# Altium schematic sheet audioCodec.SchDoc
size A4
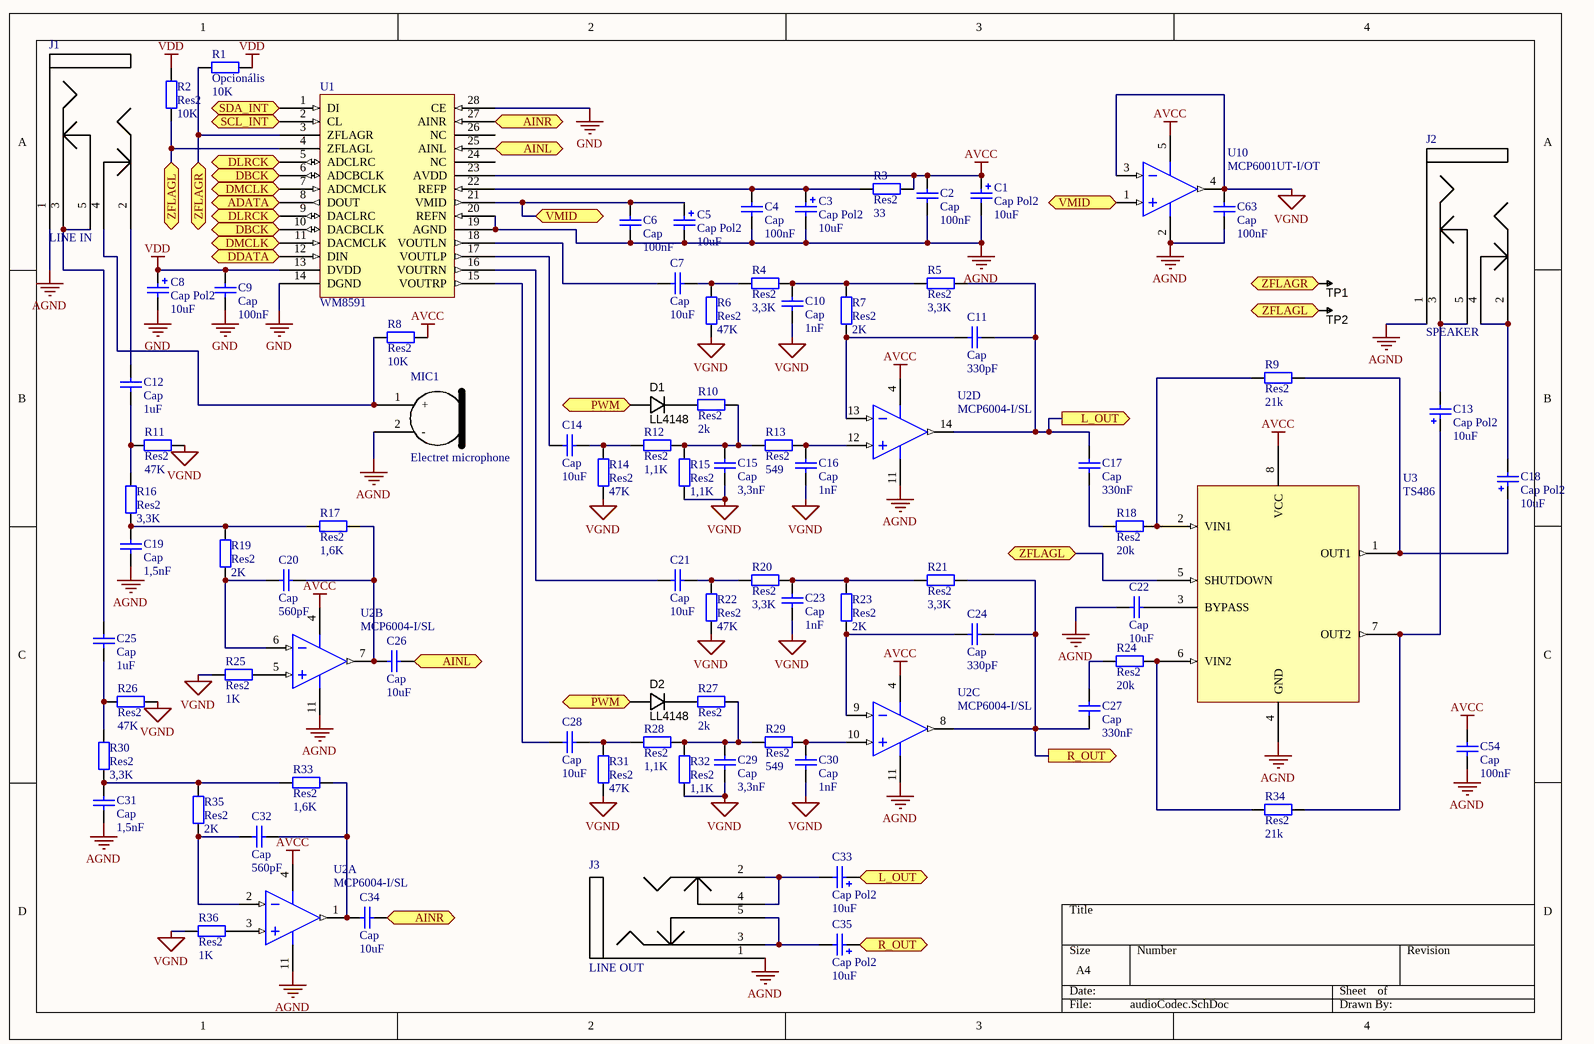
[diagram p0: audioCodec.SchDoc]

## Parts
C1  Cap Pol2  value 10uF  [CAPMP3528X210N]
C2  Cap  value 100nF  [CAPC2012X135N]
C3  Cap Pol2  value 10uF  [CAPMP3528X210N]
C4  Cap  value 100nF  [CAPC2012X135N]
C5  Cap Pol2  value 10uF  [CAPMP3528X210N]
C6  Cap  value 100nF  [CAPC2012X135N]
C7  Cap  value 10uF  [CAPC2012X135N]
C8  Cap Pol2  value 10uF  [CAPMP3528X210N]
C9  Cap  value 100nF  [CAPC2012X135N]
C10  Cap  value 1nF  [CAPC2012X135N]
C11  Cap  value 330pF  [CAPC2012X135N]
C12  Cap  value 1uF  [CAPC2012X135N]
C13  Cap Pol2  value 10uF  [CAPMP3528X210N]
C14  Cap  value 10uF  [CAPC2012X135N]
C15  Cap  value 3,3nF  [CAPC2012X135N]
C16  Cap  value 1nF  [CAPC2012X135N]
C17  Cap  value 330nF  [CAPC2012X135N]
C18  Cap Pol2  value 10uF  [CAPMP3528X210N]
C19  Cap  value 1,5nF  [CAPC2012X135N]
C20  Cap  value 560pF  [CAPC2012X135N]
C21  Cap  value 10uF  [CAPC2012X135N]
C22  Cap  value 10uF  [CAPC2012X135N]
C23  Cap  value 1nF  [CAPC2012X135N]
C24  Cap  value 330pF  [CAPC2012X135N]
C25  Cap  value 1uF  [CAPC2012X135N]
C26  Cap  value 10uF  [CAPC2012X135N]
C27  Cap  value 330nF  [CAPC2012X135N]
C28  Cap  value 10uF  [CAPC2012X135N]
C29  Cap  value 3,3nF  [CAPC2012X135N]
C30  Cap  value 1nF  [CAPC2012X135N]
C31  Cap  value 1,5nF  [CAPC2012X135N]
C32  Cap  value 560pF  [CAPC2012X135N]
C33  Cap Pol2  value 10uF  [CAPMP3528X210N]
C34  Cap  value 10uF  [CAPC2012X135N]
C35  Cap Pol2  value 10uF  [CAPMP3528X210N]
C54  Cap  value 100nF  [CAPC2012X135N]
C63  Cap  value 100nF  [CAPC2012X135N]
D1  Manufacturer Part Number 1: LL4148  [SOD80, LL-34]  (hidden comment: Mini MELF)
D2  Manufacturer Part Number 1: LL4148  [SOD80, LL-34]  (hidden comment: Mini MELF)
J1  LINE IN  [STEREO JACK 3.5 mm]
J2  SPEAKER  [STEREO JACK 3.5 mm]
J3  LINE OUT  [STEREO JACK 3.5 mm]
MIC1  Electret microphone  [MIC 10 mm]
R1  Opcionális  value 10K  [RESC2012X70N]
R2  Res2  value 10K  [RESC2012X70N]
R3  Res2  value 33  [RESC2012X70N]
R4  Res2  value 3,3K  [RESC2012X70N]
R5  Res2  value 3,3K  [RESC2012X70N]
R6  Res2  value 47K  [RESC2012X70N]
R7  Res2  value 2K  [RESC2012X70N]
R8  Res2  value 10K  [RESC2012X70N]
R9  Res2  value 21k  [RESC2012X70N]
R10  Res2  value 2k  [RESC2012X70N]
R11  Res2  value 47K  [RESC2012X70N]
R12  Res2  value 1,1K  [RESC2012X70N]
R13  Res2  value 549  [RESC2012X70N]
R14  Res2  value 47K  [RESC2012X70N]
R15  Res2  value 1,1K  [RESC2012X70N]
R16  Res2  value 3,3K  [RESC2012X70N]
R17  Res2  value 1,6K  [RESC2012X70N]
R18  Res2  value 20k  [RESC2012X70N]
R19  Res2  value 2K  [RESC2012X70N]
R20  Res2  value 3,3K  [RESC2012X70N]
R21  Res2  value 3,3K  [RESC2012X70N]
R22  Res2  value 47K  [RESC2012X70N]
R23  Res2  value 2K  [RESC2012X70N]
R24  Res2  value 20k  [RESC2012X70N]
R25  Res2  value 1K  [RESC2012X70N]
R26  Res2  value 47K  [RESC2012X70N]
R27  Res2  value 2k  [RESC2012X70N]
R28  Res2  value 1,1K  [RESC2012X70N]
R29  Res2  value 549  [RESC2012X70N]
R30  Res2  value 3,3K  [RESC2012X70N]
R31  Res2  value 47K  [RESC2012X70N]
R32  Res2  value 1,1K  [RESC2012X70N]
R33  Res2  value 1,6K  [RESC2012X70N]
R34  Res2  value 21k  [RESC2012X70N]
R35  Res2  value 2K  [RESC2012X70N]
R36  Res2  value 1K  [RESC2012X70N]
TP1  TESTPOINT  [TP-R60]  (value not drawn)  (no BOM)
TP2  TESTPOINT  [TP-R60]  (value not drawn)  (no BOM)
U1  WM8591  [SSOP-28]
U2  MCP6004-I/SL  [SOIC-SL14_N]  (parts A,B,C,D of 4)
U3  TS486  [MSOP-MS8_M]
U10  MCP6001UT-I/OT  [SOT-23-OT5_M]

## Ports
ADATA (out), AINL (in), AINL (out), AINR (in), AINR (out), DBCK (bidir), DDATA (in), DLRCK (bidir), DMCLK (bidir), L_OUT (in), L_OUT (out), PWM, R_OUT (in), R_OUT (out), SCL_INT (bidir), SDA_INT (bidir), VMID, ZFLAGL (bidir), ZFLAGR (bidir)

## Nets
AGND: C1.2 C2.2 C3.2 C4.2 C5.2 C6.2 C19.2 C22.2 C31.2 C54.2 C63.2 J1.1 J2.1 J3.1 MIC1.2(-) U1.19(AGND) U1.20(REFN) U2.11(VSS) U3.4(GND) U10.2(VSS)
AVCC: C1.1 C2.1 C54.1 R3.1 R8.2 U1.23(AVDD) U2.4(VDD) U3.8(VCC) U10.5(VDD)
GND: C8.2 C9.2 U1.14(DGND) U1.28(CE)
VDD: C8.1 C9.1 R1.1 R2.1 U1.13(DVDD)
VGND: C10.2 C15.2 C16.2 C23.2 C29.2 C30.2 C63.1 R6.1 R11.2 R14.1 R15.2 R22.1 R25.2 R26.2 R31.1 R32.2 R36.2 U10.3(VIN-) U10.4(VOUT)
ADATA: U1.8(DOUT) ; port ADATA
AINL: C26.1 U1.25(AINL) ; port AINL
AINR: C34.1 U1.27(AINR) ; port AINR
DBCK: U1.6(ADCBCLK) U1.10(DACBCLK) ; port DBCK
DDATA: U1.12(DIN) ; port DDATA
DLRCK: U1.5(ADCLRC) U1.9(DACLRC) ; port DLRCK
DMCLK: U1.7(ADCMCLK) U1.11(DACMCLK) ; port DMCLK
L_OUT: C11.2 C17.1 C33.1 R5.1 U2.14(VOUTD) ; port L_OUT
PWM: D1.A D2.A ; port PWM
R_OUT: C24.2 C27.2 C35.1 R21.1 U2.8(VOUTC) ; port R_OUT
SCL_INT: U1.2(CL) ; port SCL_INT
SDA_INT: U1.1(DI) ; port SDA_INT
VMID: C5.1 C6.1 U1.21(VMID) U10.1(VIN+) ; port VMID
ZFLAGL: R2.2 TP2.1 U1.4(ZFLAGL) U3.5(SHUTDOWN) ; port ZFLAGL
ZFLAGR: R1.2 TP1.1 U1.3(ZFLAGR) ; port ZFLAGR
NetC3_1: C3.1 C4.1 R3.2 U1.22(REFP)
NetC7_1: C7.1 R4.2 R6.2
NetC7_2: C7.2 U1.18(VOUTLN)
NetC10_1: C10.1 R4.1 R5.2 R7.2
NetC11_1: C11.1 R7.1 U2.13(VIND-)
NetC12_1: C12.1 J1.2
NetC12_2: C12.2 R11.1 R16.1
NetC13_1: C13.1 R34.1 U3.7(OUT2)
NetC13_2: C13.2 J2.3 J2.5
NetC14_1: C14.1 R12.2 R14.2
NetC14_2: C14.2 U1.17(VOUTLP)
NetC15_1: C15.1 R10.1 R12.1 R13.2 R15.1
NetC16_1: C16.1 R13.1 U2.12(VIND+)
NetC17_2: C17.2 R18.2
NetC18_1: C18.1 R9.1 U3.1(OUT1)
NetC18_2: C18.2 J2.2 J2.4
NetC19_1: C19.1 R16.2 R17.2 R19.2
NetC20_1: C20.1 C26.2 R17.1 U2.7(VOUTB)
NetC20_2: C20.2 R19.1 U2.6(VINB-)
NetC21_1: C21.1 R20.2 R22.2
NetC21_2: C21.2 U1.16(VOUTRN)
NetC22_1: C22.1 U3.3(BYPASS)
NetC23_1: C23.1 R20.1 R21.2 R23.2
NetC24_1: C24.1 R23.1 U2.9(VINC-)
NetC25_1: C25.1 J1.3 J1.5
NetC25_2: C25.2 R26.1 R30.1
NetC27_1: C27.1 R24.2
NetC28_1: C28.1 R28.2 R31.2
NetC28_2: C28.2 U1.15(VOUTRP)
NetC29_1: C29.1 R27.2 R28.1 R29.2 R32.1
NetC30_1: C30.1 R29.1 U2.10(VINC+)
NetC31_1: C31.1 R30.2 R33.2 R35.2
NetC32_1: C32.1 C34.2 R33.1 U2.1(VOUTA)
NetC32_2: C32.2 R35.1 U2.2(VINA-)
NetC33_2: C33.2 J3.2 J3.4
NetC35_2: C35.2 J3.3 J3.5
NetD1_K: D1.K R10.2
NetD2_K: D2.K R27.1
NetJ1_4: J1.4 MIC1.1(+) R8.1
NetR9_2: R9.2 R18.1 U3.2(VIN1)
NetR24_1: R24.1 R34.2 U3.6(VIN2)
NetR25_1: R25.1 U2.5(VINB+)
NetR36_1: R36.1 U2.3(VINA+)

Not connected (* = marked no-connect by the designer): U1 24(NC) 26(NC)

## Library data of the parts
C1 C3 C5 C8 C13 C18 C33 C35 = Cap Pol2: Polarized Capacitor (Axial); Published: 8-Jun-2000; LatestRevisionDate: 17-Jul-2002; LatestRevisionNote: Re-released for DXP Platform.; PackageReference: POLAR0.8; Publisher: Altium Limited; PackageDescription: Polarized Capacitor; 2 Leads
C2 C4 C6 C7 C9-C12 C14-C17 C19-C32 C34 C54 C63 = Cap: Capacitor; Published: 8-Jun-2000; LatestRevisionDate: 17-Jul-2002; LatestRevisionNote: Re-released for DXP Platform.; PackageReference: RAD-0.3; Publisher: Altium Limited; PackageDescription: Radial Cap, Thru-Hole; 2 Leads; 0.3 in Pin Spacing
D1 D2 = DIODE_100V_500mW_MELF: Diode SMD 100V 150mA 500mW SOD80; Manufacturer 1: Fairchild Semiconductor; Ratings: 100V; 150mA min; 500mW; Material: Si; Diode Type: Standard; Value: Vf=1V @ 10mA; SCDType: source; Package / Case: SOD80, LL-34; Manufacturer 2: DC Components; Manufacturer Part Number 2: DL4148; Supplier 1: Digi-Key; Supplier Part Number 1: LL4148FSCT-ND
J1-J3 = STEREO JACK: Sztereo audio csatlakozó 3,5 mm
MIC1 = Electret microphone: Elektret mikrofon kapszula
R1-R36 = Res2: Resistor; Published: 8-Jun-2000; LatestRevisionDate: 17-Jul-2002; LatestRevisionNote: Re-released for DXP Platform.; PackageReference: AXIAL-0.4; Publisher: Altium Limited; PackageDescription: Axial Device, Thru-Hole; 2 Leads; 0.4 in Pin Spacing
TP1 TP2 = TESTPOINT: SMD test pin
U1 = WM8591: WM8591 AUDIO CODEC
U2 = MCP6004-I/SL: 1 MHz, Low-Power Operational Amplifier, 14-Pin SOIC, Industrial Temperature; Published: 29-Jan-2009; LatestRevisionDate: 02-Dec-2009; LatestRevisionNote: Updated to datasheet revision J, Nov-2009; DatasheetVersion: revJ, Nov-2009; PackageVersion: revBB, Aug-2009; PackageReference: SOIC-SL14; Publisher: Altium Limited; PackageDescription: 14-Lead Plastic Small Outline (SL) - Narrow, 3.90mm Body [SOIC]; Supplier 1: Digi-Key; Supplier Part Number 1: MCP6004-I/SL-ND; Supplier 2: Farnell; Supplier Part Number 2: 6530837; Code_JEDEC: MS-012-AB; Code_IPC: SOIC127P600-14; ComponentLink1Description: Datasheet; ComponentLink1URL: http://ww1.microchip.com/downloads/en/DeviceDoc/21733j.pdf; ComponentLink2Description: Packaging Specification; ComponentLink2URL: http://www.microchip.com/stellent/groups/techpub_sg/documents/packagingspec/en012702.pdf; ComponentLink3Description: Microchip.com Home; ComponentLink3URL: http://www.microchip.com/
U3 = TS486: 0.1 W audio amplifier
U10 = MCP6001UT-I/OT: 1 MHz, Low-Power Operational Amplifier, 5-Pin SOT-23, Industrial Temperature, Tape and Reel; Published: 29-Jan-2009; LatestRevisionDate: 02-Dec-2009; LatestRevisionNote: Updated to datasheet revision J, Nov-2009; DatasheetVersion: revJ, Nov-2009; PackageVersion: revBB, Aug-2009; PackageReference: SOT-23-OT5; Publisher: Altium Limited; PackageDescription: 5-Lead Plastic Small Outline Transistor (OT) [SOT-23]; Supplier 1: Digi-Key; Supplier Part Number 1: MCP6001UT-I/OTTR-ND; Supplier 2: Digi-Key; Supplier Part Number 2: MCP6001UT-I/OTCT-ND; Supplier 3: Digi-Key; Supplier Part Number 3: MCP6001UT-I/OTDKR-ND; Supplier 4: Farnell; Supplier Part Number 4: 8540845; Code_IPC: SOT23-5; ComponentLink1Description: Datasheet; ComponentLink1URL: http://ww1.microchip.com/downloads/en/DeviceDoc/21733j.pdf; ComponentLink2Description: Packaging Specification; ComponentLink2URL: http://www.microchip.com/stellent/groups/techpub_sg/documents/packagingspec/en012702.pdf; ComponentLink3Description: Microchip.com Home; ComponentLink3URL: http://www.microchip.com/